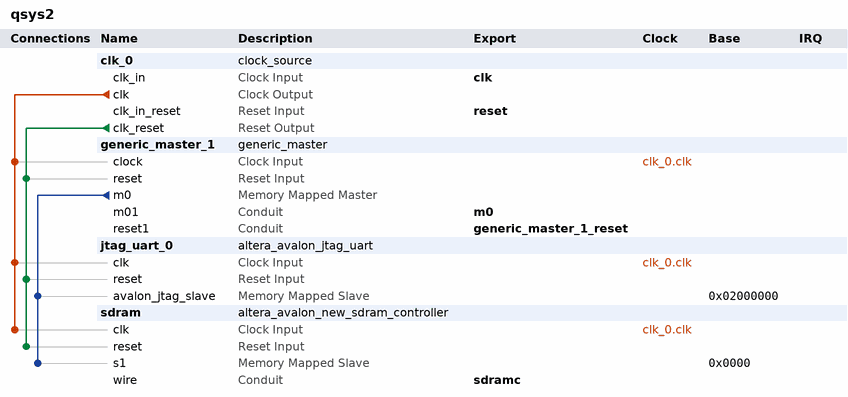
[diagram p0: system contents]
# Platform Designer (Qsys) system qsys2, Cyclone IV E EP4CE22F17C6
# Parameters at their usual value, and those the tool derives, are not listed.
package require -exact qsys 13.0.1
create_system qsys2
set_project_property DEVICE_FAMILY {Cyclone IV E}
set_project_property DEVICE EP4CE22F17C6

add_instance clk_0 clock_source 13.0
set_instance_parameter_value clk_0 clockFrequency 50000000

add_instance generic_master_1 generic_master 1.0

add_instance jtag_uart_0 altera_avalon_jtag_uart 13.0.1
set_instance_parameter_value jtag_uart_0 readBufferDepth 8
set_instance_parameter_value jtag_uart_0 readIRQThreshold 1
set_instance_parameter_value jtag_uart_0 simInteractiveOptions NO_INTERACTIVE_WINDOWS
set_instance_parameter_value jtag_uart_0 writeBufferDepth 8
set_instance_parameter_value jtag_uart_0 writeIRQThreshold 2

add_instance sdram altera_avalon_new_sdram_controller 13.0.1
set_instance_parameter_value sdram TAC 5.5
set_instance_parameter_value sdram TRCD 20.0
set_instance_parameter_value sdram TRP 20.0
set_instance_parameter_value sdram casLatency 3
set_instance_parameter_value sdram columnWidth 9
set_instance_parameter_value sdram dataWidth 16
set_instance_parameter_value sdram generateSimulationModel true
set_instance_parameter_value sdram model single_Micron_MT48LC4M32B2_7_chip
set_instance_parameter_value sdram numberOfBanks 4
set_instance_parameter_value sdram numberOfChipSelects 1
set_instance_parameter_value sdram powerUpDelay 100.0
set_instance_parameter_value sdram refreshPeriod 15.625
set_instance_parameter_value sdram rowWidth 13

# connections
add_connection clk_0.clk generic_master_1.clock clock
add_connection clk_0.clk jtag_uart_0.clk clock
add_connection clk_0.clk sdram.clk clock
add_connection clk_0.clk_reset generic_master_1.reset reset
add_connection clk_0.clk_reset jtag_uart_0.reset reset
add_connection clk_0.clk_reset sdram.reset reset
add_connection generic_master_1.m0 jtag_uart_0.avalon_jtag_slave avalon
set_connection_parameter_value generic_master_1.m0/jtag_uart_0.avalon_jtag_slave baseAddress 0x02000000
add_connection generic_master_1.m0 sdram.s1 avalon
set_connection_parameter_value generic_master_1.m0/sdram.s1 baseAddress 0x0000

# exported interfaces
add_interface clk clock sink
set_interface_property clk EXPORT_OF clk_0.clk_in
add_interface reset reset sink
set_interface_property reset EXPORT_OF clk_0.clk_in_reset
add_interface sdramc conduit end
set_interface_property sdramc EXPORT_OF sdram.wire
add_interface m0 conduit end
set_interface_property m0 EXPORT_OF generic_master_1.m01
add_interface generic_master_1_reset conduit end
set_interface_property generic_master_1_reset EXPORT_OF generic_master_1.reset1

set_interconnect_requirement {$system} qsys_mm.clockCrossingAdapter HANDSHAKE
set_interconnect_requirement {$system} qsys_mm.maxAdditionalLatency 1

save_system qsys2.qsys
